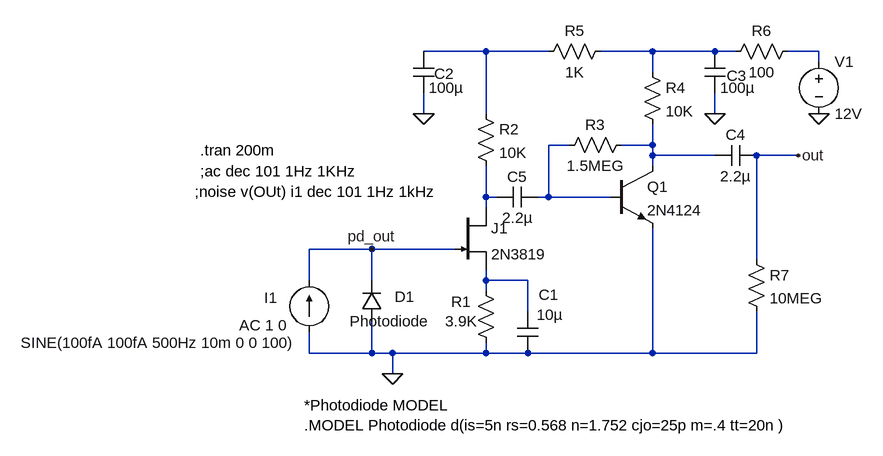
[diagram p0: schematic photorx.asc]
photorx.asc, the LTspice schematic file:
Version 4
SHEET 1 1528 680
WIRE -160 144 -160 96
WIRE -160 96 -64 96
WIRE -64 96 -64 144
WIRE -64 208 -64 256
WIRE -64 256 -160 256
WIRE -160 256 -160 224
WIRE -32 288 -32 256
WIRE -64 96 64 96
WIRE 112 32 112 16
WIRE 112 128 112 144
WIRE 112 240 112 256
WIRE 112 256 -32 256
WIRE -32 256 -64 256
WIRE 176 192 176 144
WIRE 176 144 112 144
WIRE 112 144 112 160
WIRE 176 256 112 256
WIRE 112 -112 112 -208
WIRE 112 -208 208 -208
WIRE 304 16 208 16
WIRE 112 16 112 -32
WIRE 208 -64 240 -64
WIRE 368 -64 368 -48
WIRE 288 -208 368 -208
WIRE 16 -208 112 -208
WIRE 16 -112 16 -144
WIRE 320 -64 368 -64
WIRE 208 -64 208 16
WIRE 208 16 192 16
WIRE 368 -176 368 -208
WIRE 368 -208 464 -208
WIRE 368 -96 368 -64
WIRE 464 -112 464 -144
WIRE 464 -208 496 -208
WIRE 368 64 368 256
WIRE 368 256 176 256
WIRE 464 -48 368 -48
WIRE 368 -48 368 -32
WIRE 368 256 528 256
WIRE 528 256 528 192
WIRE 528 -48 528 112
WIRE 576 -208 624 -208
WIRE 624 -208 624 -192
WIRE 528 -48 592 -48
WIRE 128 16 112 16
FLAG -32 288 0
FLAG -64 96 pd_out
FLAG 16 -112 0
FLAG 464 -112 0
FLAG 624 -112 0
FLAG 592 -48 out
SYMBOL diode -48 208 R180
WINDOW 0 -50 39 Left 0
WINDOW 3 -72 1 Left 0
SYMATTR InstName D1
SYMATTR Value Photodiode
SYMBOL current -160 224 R180
WINDOW 123 34 11 Left 0
WINDOW 39 0 0 Left 0
WINDOW 0 49 53 Left 0
WINDOW 3 21 -16 Left 0
SYMATTR Value2 AC 1 0
SYMATTR InstName I1
SYMATTR Value SINE(100fA 100fA 500Hz 10m 0 0 100)
SYMBOL njf 64 32 R0
SYMATTR InstName J1
SYMATTR Value 2N3819
SYMBOL res 96 144 R0
WINDOW 0 -38 33 Left 0
WINDOW 3 -47 63 Left 0
SYMATTR InstName R1
SYMATTR Value 3.9K
SYMBOL res 96 -128 R0
SYMATTR InstName R2
SYMATTR Value 10K
SYMBOL cap 160 192 R0
WINDOW 0 33 -26 Left 0
WINDOW 3 30 5 Left 0
SYMATTR InstName C1
SYMATTR Value 10µ
SYMBOL npn 304 -32 R0
SYMATTR InstName Q1
SYMATTR Value 2N4124
SYMBOL res 336 -80 R90
WINDOW 0 0 56 VBottom 0
WINDOW 3 32 56 VTop 0
SYMATTR InstName R3
SYMATTR Value 1.5MEG
SYMBOL res 352 -192 R0
SYMATTR InstName R4
SYMATTR Value 10K
SYMBOL res 304 -224 R90
WINDOW 0 0 56 VBottom 0
WINDOW 3 32 56 VTop 0
SYMATTR InstName R5
SYMATTR Value 1K
SYMBOL cap 0 -208 R0
WINDOW 0 32 34 Left 0
SYMATTR InstName C2
SYMATTR Value 100µ
SYMBOL res 592 -224 R90
WINDOW 0 0 56 VBottom 0
WINDOW 3 32 56 VTop 0
SYMATTR InstName R6
SYMATTR Value 100
SYMBOL cap 448 -208 R0
WINDOW 0 34 37 Left 0
SYMATTR InstName C3
SYMATTR Value 100µ
SYMBOL cap 528 -64 R90
WINDOW 0 0 32 VBottom 0
WINDOW 3 32 32 VTop 0
SYMATTR InstName C4
SYMATTR Value 2.2µ
SYMBOL res 512 96 R0
SYMATTR InstName R7
SYMATTR Value 10MEG
SYMBOL voltage 624 -208 R0
SYMATTR InstName V1
SYMATTR Value 12V
SYMBOL cap 192 0 R90
WINDOW 0 0 32 VBottom 0
WINDOW 3 32 32 VTop 0
SYMATTR InstName C5
SYMATTR Value 2.2µ
TEXT -328 -24 Left 0 !;ac dec 101 1Hz 1KHz
TEXT -336 8 Left 0 !;noise v(OUt) i1 dec 101 1Hz 1kHz
TEXT -168 336 Left 0 !*Photodiode MODEL\n.MODEL Photodiode d(is=5n rs=0.568 n=1.752 cjo=25p m=.4 tt=20n )
TEXT -328 -56 Left 0 !.tran 200m

The netlist it stands for:
* photorx.asc
D1 0 pd_out Photodiode
I1 0 pd_out SINE(100fA 100fA 500Hz 10m 0 0 100) AC 1 0
J1 N001 pd_out N002 2N3819
R1 N002 0 3.9K
R2 N003 N001 10K
C1 N002 0 10µ
Q1 N005 N004 0 0 2N4124
R3 N005 N004 1.5MEG
R4 N006 N005 10K
R5 N006 N003 1K
C2 N003 0 100µ
R6 N007 N006 100
C3 N006 0 100µ
C4 out N005 2.2µ
R7 out 0 10MEG
V1 N007 0 12V
C5 N004 N001 2.2µ
.model D D
.lib standard.dio
.model NPN NPN
.model PNP PNP
.lib standard.bjt
.model NJF NJF
.model PJF PJF
.lib standard.jft
;ac dec 101 1Hz 1KHz
;noise v(OUt) i1 dec 101 1Hz 1kHz
*Photodiode MODEL
.MODEL Photodiode d(is=5n rs=0.568 n=1.752 cjo=25p m=.4 tt=20n )
.tran 200m
.backanno
.end